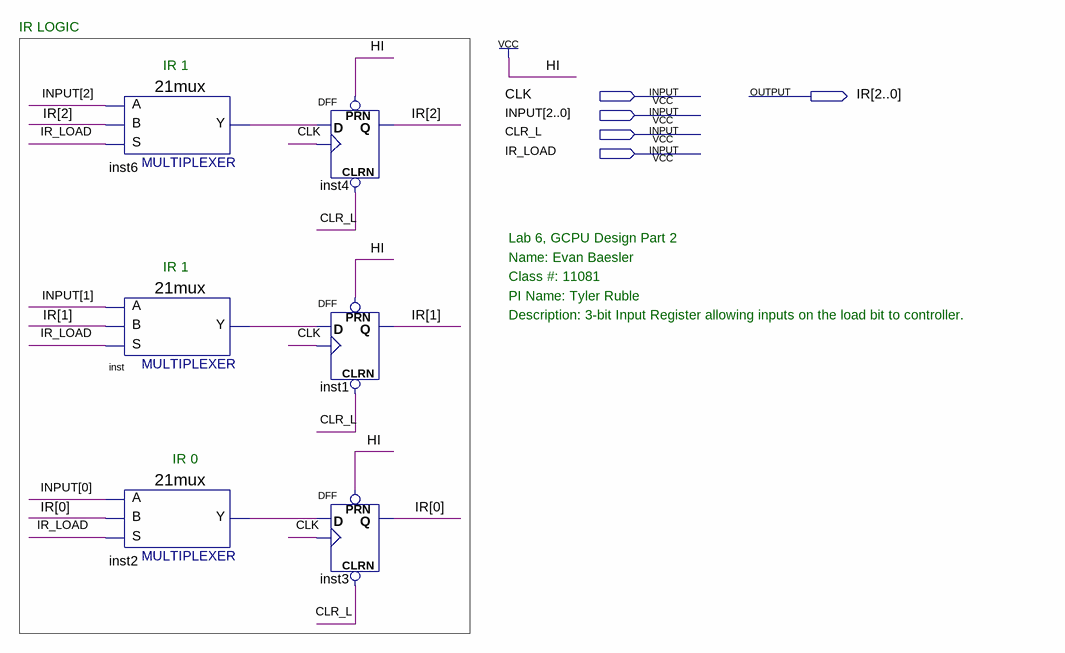
[diagram p0: schematic sheet]
// Quartus schematic Lab6_IR.bdf as structural Verilog: 6 symbols, 5 pins
module Lab6_IR (
  input  CLK,
  input  [2:0] INPUT,
  input  CLR_L,
  input  IR_LOAD,
  output [2:0] IR
);

  wire inst2_y, inst6_y, inst_y;

  \21mux  inst6 (.S(IR_LOAD), .B(IR[2]), .A(INPUT[2]), .Y(inst6_y));
  \21mux  inst (.S(IR_LOAD), .B(IR[1]), .A(INPUT[1]), .Y(inst_y));
  \21mux  inst2 (.S(IR_LOAD), .B(IR[0]), .A(INPUT[0]), .Y(inst2_y));
  DFF inst4 (.CLRN(CLR_L), .CLK(CLK), .D(inst6_y), .PRN(1'b1), .Q(IR[2]));
  DFF inst1 (.CLRN(CLR_L), .CLK(CLK), .D(inst_y), .PRN(1'b1), .Q(IR[1]));
  DFF inst3 (.CLRN(CLR_L), .CLK(CLK), .D(inst2_y), .PRN(1'b1), .Q(IR[0]));

  // Notes on the sheet:
  //   IR LOGIC
  //   IR 1
  //   Lab 6, GCPU Design Part 2
  //   Name: Evan Baesler
  //   IR 1
  //   Class #: 11081
  //   PI Name: Tyler Ruble
  //   Description: 3-bit Input Register allowing inputs on the load bit to controller.
  //   IR 0
endmodule
